# Altium project smart home 2.PrjPcb
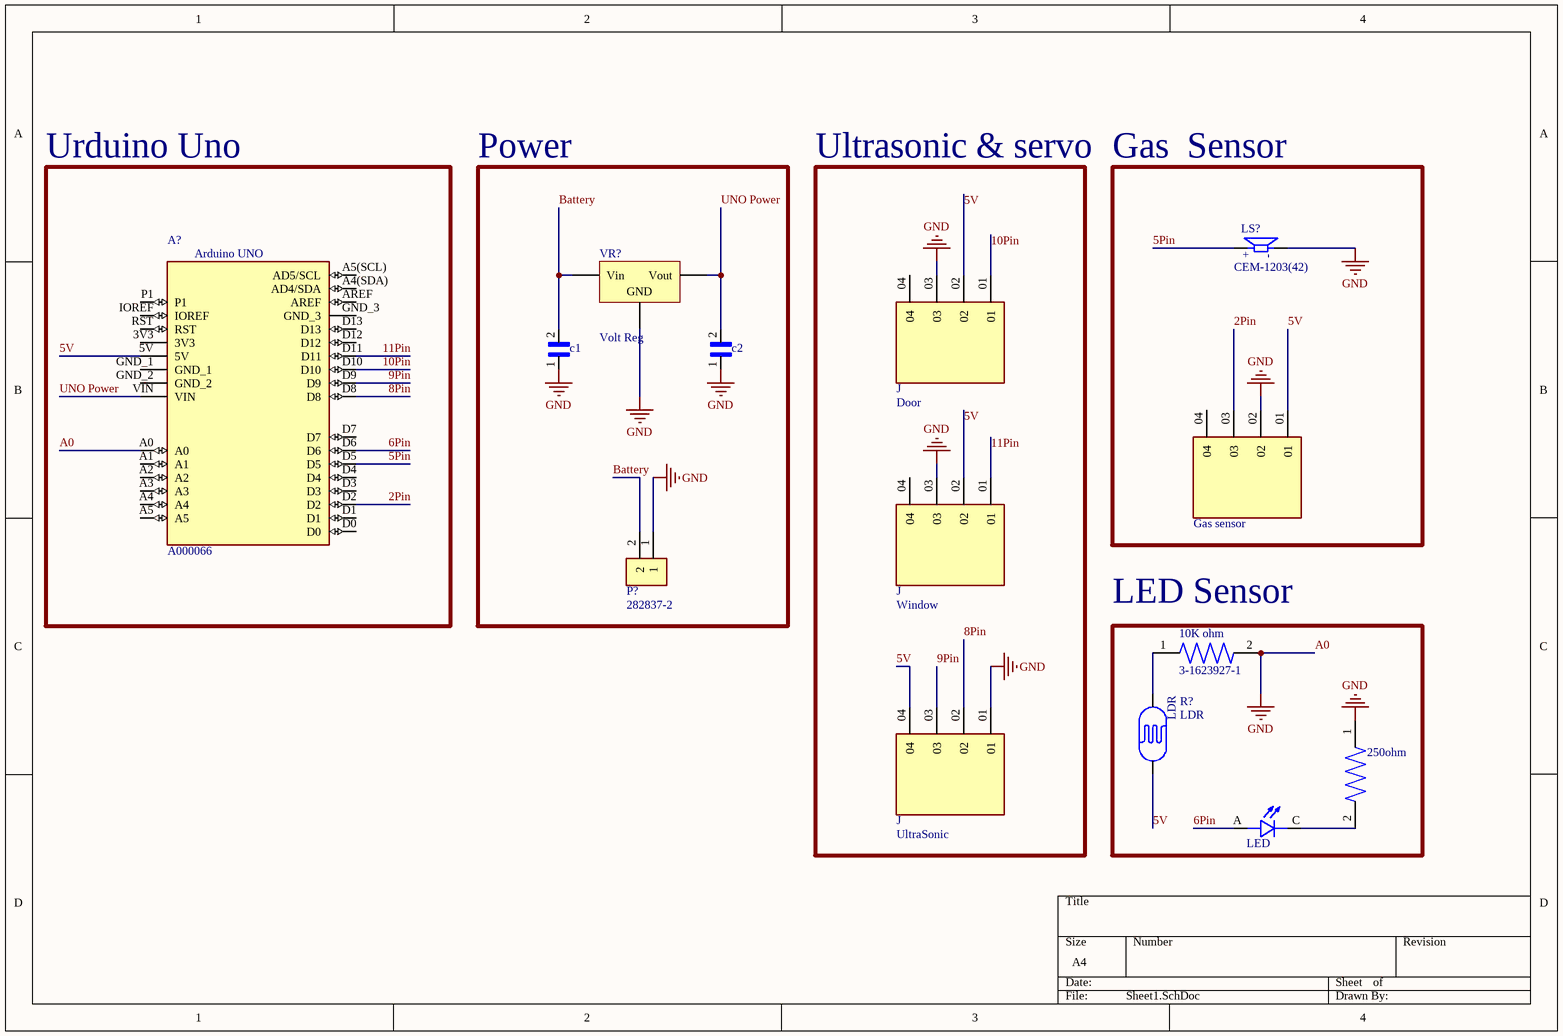
[diagram p0: Sheet1.SchDoc]
1 sheet, 14 parts. Net scope: global (net labels, ports and power ports of the same name join across sheets).
Board file: PCB1.PcbDoc

## Sheet Sheet1.SchDoc
size A4; SheetNumber: 1; SheetTotal: 1

### Parts
(Parts that share a designator on the sheet are numbered #1, #2 ... from top to bottom, then left to right.)
10K_ohm  3-1623927-1  [RESAD700W45L350D185]
250ohm  (no value)  [RESAD700W45L350D185]
A?  A000066  [ARDUINO_A000066]
c1  FA14X8R1H104KNU06  [CAPRB250W50L450T300H550]  (value not drawn)
c2  FA14X8R1H104KNU06  [CAPRB250W50L450T300H550]  (value not drawn)
Gas_sensor  TSW-120-18-T-S  [SAMTEC_TSW-120-18-T-S]  (value not drawn)
J#1  Door  [SAMTEC_TSW-120-18-T-S]
J#2  Window  [SAMTEC_TSW-120-18-T-S]
J#3  UltraSonic  [SAMTEC_TSW-120-18-T-S]
LED  L08R5000Q1  [LEDRD254W57D500H1070]  (value not drawn)
LS?  CEM-1203(42)  [CUI_CEM-1203(42)]
P?  282837-2  [TE_282837-2]
R?  LDR  [LDR]
VR?  Volt Reg  [TO-220-3]

### Blocks framed on the sheet
Urduino Uno: A?
Power: c1 c2 P? VR?
Ultrasonic & servo: J#1-J#3
Gas  Sensor: Gas_sensor LS?
LED Sensor: 10K_ohm 250ohm LED R?

### Nets
A0: 10K_ohm.2 250ohm.1 A?.A0 c1.1 c2.1 Gas_sensor.02 J#1.03 J#2.03 J#3.01 LS?.N P?.1 VR?.2(GND)  [also labelled GND]
2Pin: A?.D2 Gas_sensor.03
5Pin: A?.D5 LS?.P
5V: A?.5V Gas_sensor.01 J#1.02 J#2.02 J#3.04 R?.1(P$1)
6Pin: A?.D6 LED.A
8Pin: A?.D8 J#3.02
9Pin: A?.D9 J#3.03
10Pin: A?.D10 J#1.01
11Pin: A?.D11 J#2.01
Battery: c1.2 P?.2 VR?.1(Vin)
UNO Power: A?.VIN c2.2 VR?.3(Vout)
Net10K_ohm_1: 10K_ohm.1 R?.2(P$2)
Net250ohm_2: 250ohm.2 LED.C

Not connected (* = marked no-connect by the designer): A? 3V3 A1 A2 A3 A4 A4(SDA)(AD4/SDA) A5 A5(SCL)(AD5/SCL) AREF D0 D1 D3 D4 D7 D12 D13 GND_1 GND_2 GND_3 IOREF P1 RST; Gas_sensor 04; J#1 04; J#2 04

### Notes on the sheet
- (in symbol A000066) Arduino UNO
- (in symbol CEM-1203(42)) +; -

### Library data of the parts
10K_ohm 250ohm = 3-1623927-1: 1 MOhms Â±5% 0.25W, 1/4W Through Hole Resistor Axial - Carbon Film; MF: TE Connectivity; Price: None; SnapEDA_Link: https://www.snapeda.com/parts/3-1623927-1/TE+Connectivity/view-part/?ref=snap; Check_prices: https://www.snapeda.com/parts/3-1623927-1/TE+Connectivity/view-part/?ref=eda; Value: *; MP: 3-1623927-1; Package: None; Availability: In Stock
A? = A000066: Microcontroller board based on the ATmega328P.; pin to pad: A4(SDA)>A4(SDA; MF: Arduino; MP: Arduino Uno Rev3; Value: *; SnapEDA_Link: https://www.snapeda.com/parts/Arduino%20Uno%20Rev3/Arduino/view-part/?ref=snap; Availability: Not in stock; Price: None; Package: Non-Standard Arduino; Check_prices: https://www.snapeda.com/parts/Arduino%20Uno%20Rev3/Arduino/view-part/?ref=eda
c1 c2 = FA14X8R1H104KNU06: 0.1 ÂµF Â±10% 50V Ceramic Capacitor X8R Radial; MF: TDK; Check_prices: https://www.snapeda.com/parts/FA14X8R1H104KNU06/TDK/view-part/?ref=eda; Purchase-URL: https://pricing.snapeda.com/search/part/FA14X8R1H104KNU06/?ref=eda; Price: None; Availability: In Stock; Package: Radial TDK; SnapEDA_Link: https://www.snapeda.com/parts/FA14X8R1H104KNU06/TDK/view-part/?ref=snap; Value: *; MP: FA14X8R1H104KNU06
Gas_sensor J#1-J#3 = TSW-120-18-T-S: TSW - Samtec 2.54mm Pin Header 23.62mm Overall Pin Length 2.79mm Tail (18) - Fast Stock; Price: None; MF: Samtec; Toby_UK-Purchase-URL: https://snapeda.com/shop?store=Toby+UK&id=4806714; Package: None; Value: *; MP: TSW-120-18-T-S; SnapEDA_Link: https://www.snapeda.com/parts/TSW-120-18-T-S/Samtec/view-part/4806714/?ref=snap; Availability: Unavailable
LED = L08R5000Q1: LED, 5MM, ORANGE; LED / Lamp Size: 5mm / T-1 3/4; LED Colour: Orange; Typ Luminous Intensity: 4.3mcd; Viewing Angle: ...; MF: LED Technology; Value: *; SnapEDA_Link: https://www.snapeda.com/parts/L08R5000Q1/LED+Technology/view-part/?ref=snap; MP: L08R5000Q1; Check_prices: https://www.snapeda.com/parts/L08R5000Q1/LED+Technology/view-part/?ref=eda; Availability: In Stock; Price: None; Package: None
LS? = CEM-1203(42): 12 mm, 3.5 V, 85 dB, Through Hole, Magnetic Audio Transducer Buzzer; MF: CUI Devices; Package: None; Price: None; Check_prices: https://www.snapeda.com/parts/CEM-1203(42)/CUI+Devices/view-part/?ref=eda; Value: *; CUI_purchase_URL: https://www.cuidevices.com/product/audio/buzzers/audio-transducers/cem-1203(42)?utm_source=snapeda.com&utm_medium=referral&utm_campaign=snapedaBOM; SnapEDA_Link: https://www.snapeda.com/parts/CEM-1203(42)/CUI+Devices/view-part/?ref=snap; MP: CEM-1203(42); Availability: In Stock; Purchase-URL: https://pricing.snapeda.com/search/part/CEM-1203(42)/?ref=eda
P? = 282837-2: Ð Ð°Ð·ÑŠÐµÐ¼Ð½Ñ‹Ðµ ÐºÐ»ÐµÐ¼Ð¼Ð½Ñ‹Ðµ ÐºÐ¾Ð»Ð¾Ð´ÐºÐ¸ Ð Ð¾Ð·ÐµÑ‚ÐºÐ° 2 Ð¿Ð¾Ð»Ð¾Ð¶ÐµÐ½Ð¸Ñ 5,08 Ð¼Ð¼ ÐŸÑ€Ð¸Ð¿Ð¾Ð¹ Ð¿Ñ€ÑÐ¼Ð¾Ð¹ Ñ‡ÐµÑ€ÐµÐ· Ð¾Ñ‚Ð²ÐµÑ€ÑÑ‚Ð¸Ðµ 13,5 Ð / ÐºÐ¾Ð½Ñ‚Ð°ÐºÑ‚; MF: TE Connectivity; SnapEDA_Link: https://www.snapeda.com/parts/282837-2/TE+Connectivity+AMP+Connectors/view-part/?ref=snap; Price: None; Check_prices: https://www.snapeda.com/parts/282837-2/TE+Connectivity+AMP+Connectors/view-part/?ref=eda; Purchase-URL: https://pricing.snapeda.com/search/part/282837-2/?ref=eda; MP: 282837-2; Value: *; Availability: In Stock; Package: None
R? = LDR: MF: Fairway Electronics; Value: *; Check_prices: https://www.snapeda.com/parts/LDR/Applied+Avionics/view-part/?ref=eda; Price: None; Package: None; SnapEDA_Link: https://www.snapeda.com/parts/LDR/Applied+Avionics/view-part/?ref=snap; Availability: In Stock; MP: LDR
VR? = Volt Reg: Voltage Regulator; Published: 24-Mar-1999; LatestRevisionDate: 29-May-2009; LatestRevisionNote: IPC-7351 Footprint Added.; PackageReference: D2PAK; Publisher: Altium Limited; PackageDescription: 3-Pin Transistor Outline Package 2.54 mm Pitch, 15.1 mm Lead Span